# EAGLE design LED_Transmitter_2023_01_22_A (EAGLE 9.6.1)
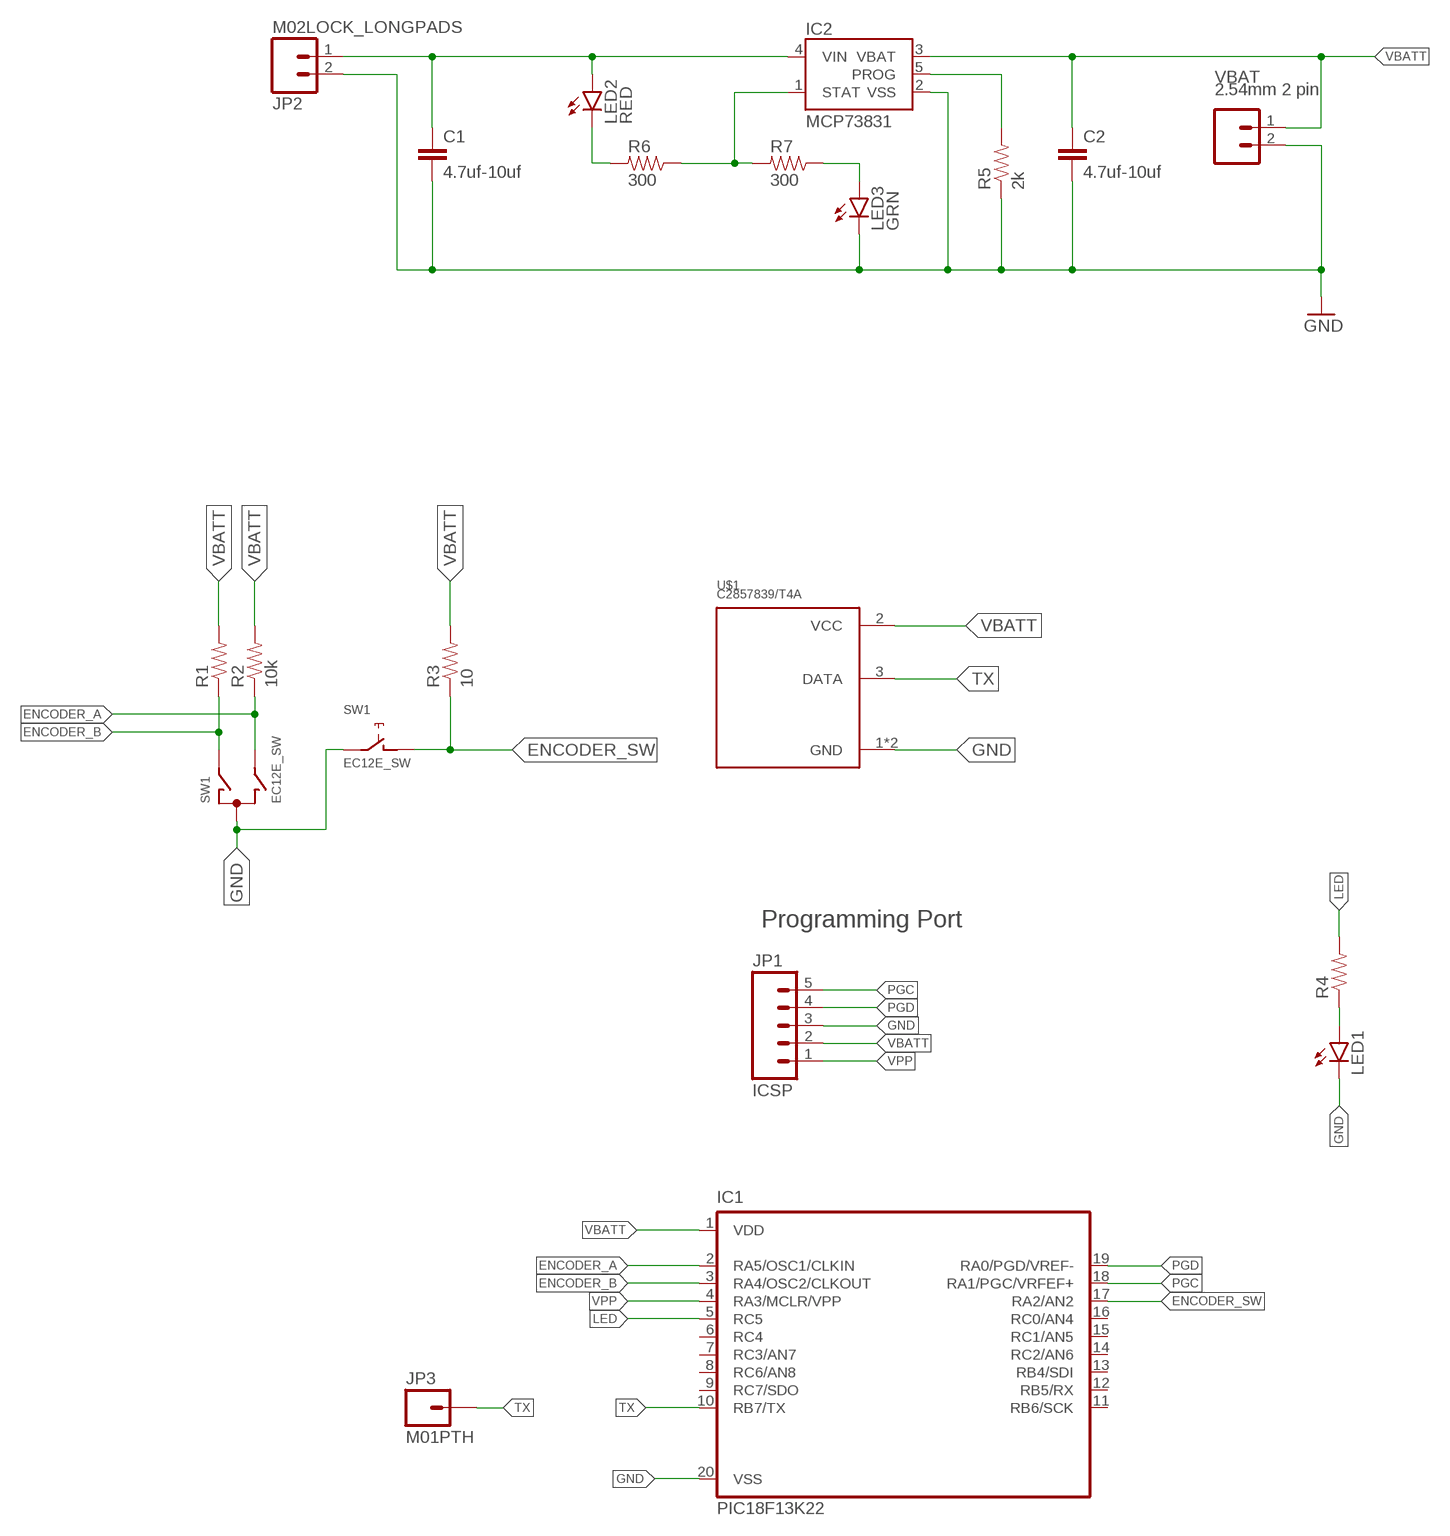
[diagram p0: schematic, sheet 1]

## Parts
C1  4.7uf-10uf  CAP1206  [1206]
C2  4.7uf-10uf  CAP1206  [1206]
IC1  PIC18F13K22  [DIL20]
IC2  MCP73831  [SOT23-5]
JP1  ICSP  M05PTH  [1X05]
JP2  M02LOCK_LONGPADS  [1X02_LOCK_LONGPADS]
JP3  M01PTH  [1X01]
LED1  LED1206  [LED-1206]
LED2  RED  LED1206  [LED-1206]
LED3  GRN  LED1206  [LED-1206]
R1  RESISTOR1206  [1206]
R2  10k  RESISTOR1206  [1206]
R3  10  RESISTOR1206  [1206]
R4  RESISTOR1206  [1206]
R5  2k  RESISTOR1206  [1206]
R6  300  RESISTOR1206  [1206]
R7  300  RESISTOR1206  [1206]
SW1  EC12E_SW  [ALPS_EC12E_SW]
U$1  C2857839/T4A  [1X04_LOCK_LONGPADS]
VBAT  2.54mm 2 pin  M02JST-PTH-VERT  [JST-2-PTH-VERT]

## Nets
ENCODER_A: IC1.2(RA5/OSC1/CLKIN) R2.1 SW1.B
ENCODER_B: IC1.3(RA4/OSC2/CLKOUT) R1.1 SW1.A
ENCODER_SW: IC1.17(RA2/AN2) R3.1 SW1.D
GND: C1.2 C2.2 IC1.20(VSS) IC2.2(VSS) JP1.3 JP2.2 LED1.C LED3.C R5.1 SW1.C SW1.E U$1.1(GND) U$1.4(GND) VBAT.2
LED: IC1.5(RC5) R4.2
N$1: LED1.A R4.1
N$3: LED2.C R6.2
N$6: IC2.1(STAT) R6.1 R7.2
N$7: IC2.5(PROG) R5.2
N$9: LED3.A R7.1
PGC: IC1.18(RA1/PGC/VRFEF+) JP1.5
PGD: IC1.19(RA0/PGD/VREF-) JP1.4
TX: IC1.10(RB7/TX) JP3.1 U$1.3(DATA)
VBATT: C2.1 IC1.1(VDD) IC2.3(VBAT) JP1.2 R1.2 R2.2 R3.2 U$1.2(VCC) VBAT.1
VBUS: C1.1 IC2.4(VIN) JP2.1 LED2.A
VPP: IC1.4(RA3/MCLR/VPP) JP1.1
Unconnected: IC1.6(RC4) IC1.7(RC3/AN7) IC1.8(RC6/AN8) IC1.9(RC7/SDO) IC1.11(RB6/SCK) IC1.12(RB5/RX) IC1.13(RB4/SDI) IC1.14(RC2/AN6) IC1.15(RC1/AN5) IC1.16(RC0/AN4) SW1.GND1(G) SW1.GND2(G)

## Notes on the sheet
- Programming Port

## Library data of the parts
C1 C2 = SparkFun-Capacitors:CAP: Capacitor Standard 0603 ceramic capacitor, and 0.1" leaded capacitor.
IC1 = PIC18F13k22:PIC18F13K22?: 18/20/28-Pin High-Performance, Enhanced Flash Microcontrollers with 10-bit A/D and nanoWatt Technology Source: ww1.microchip.com/downloads/en/DeviceDoc/39605c.pdf
IC2 = SparkFun-PowerIC:MCP73831: Miniature single cell, fully integrated Li-Ion, Li-polymer charge management controller http://ww1.microchip.com/downloads/en/DeviceDoc/21984a.pdf IC-09995; PROD_ID: IC-09995
JP1 = SparkFun-Connectors:M05: Header 5 Standard 5-pin 0.1" header. Use with straight break away headers (SKU : PRT-00116), right angle break away headers (PRT-00553), swiss pins (PRT-00743), machine pins (PRT-00117), and female headers (PRT-00115). Molex polarized connector foot print use with SKU : PRT-08230 with associated crimp pins and housings.
JP2 VBAT = SparkFun-Connectors:M02: Standard 2-pin 0.1" header. Use with - straight break away headers ( PRT-00116) - right angle break away headers (PRT-00553) - swiss pins (PRT-00743) - machine pins (PRT-00117) - female headers (PRT-00115) Molex polarized connector foot print use with: PRT-08233 with associated crimp pins and housings. 2.54_SCREWTERM for use with PRT-10571. 3.5mm Screw Terminal footprints for PRT-08084 5mm Screw Terminal footprints for use with PRT-08432
JP3 = SparkFun-Connectors:M01: Header 1 Standard 1-pin 0.1" header. Use with straight break away headers (SKU : PRT-00116), right angle break away headers (PRT-00553), swiss pins (PRT-00743), machine pins (PRT-00117), and female headers (PRT-00115).
LED1-LED3 = SparkFun-LED:LED: LEDs Standard schematic elements and footprints for 5mm, 3mm, 1206, and 0603 sized LEDs. 5mm - Spark Fun Electronics SKU : COM-00529 (and others)
R1-R7 = SparkFun-Resistors:RESISTOR: Resistor Basic schematic elements and footprints for 0603, 1206, and PTH resistors.
SW1 = switch-alps:EC12E_SW: ALPS rotary Encoder EC12E series with switch; MPN: EC12E2424407; OC_FARNELL: 1520813; OC_NEWARK: 74M1068
U$1 = Feng Niao RF Library:C2857839/T4A: C2857839//Yuan T4A Transmitter

## Board
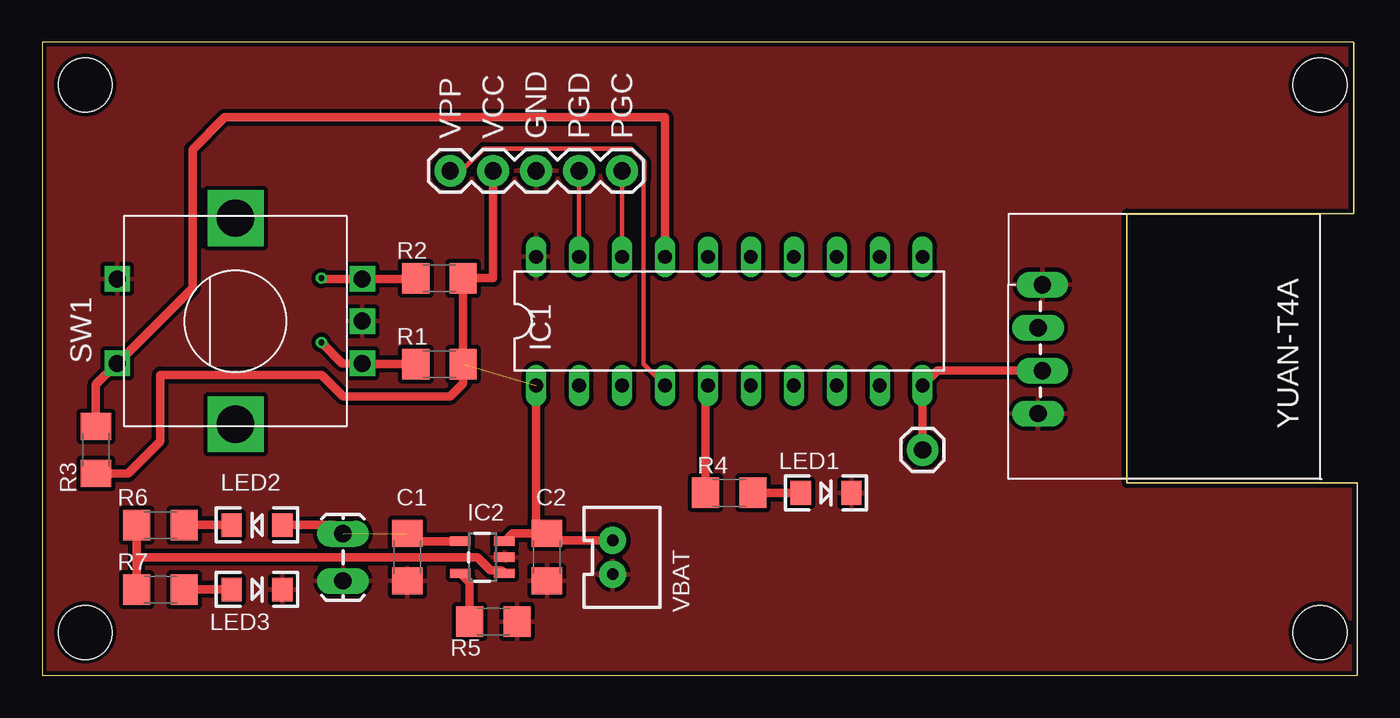
[diagram p1: board, top side]
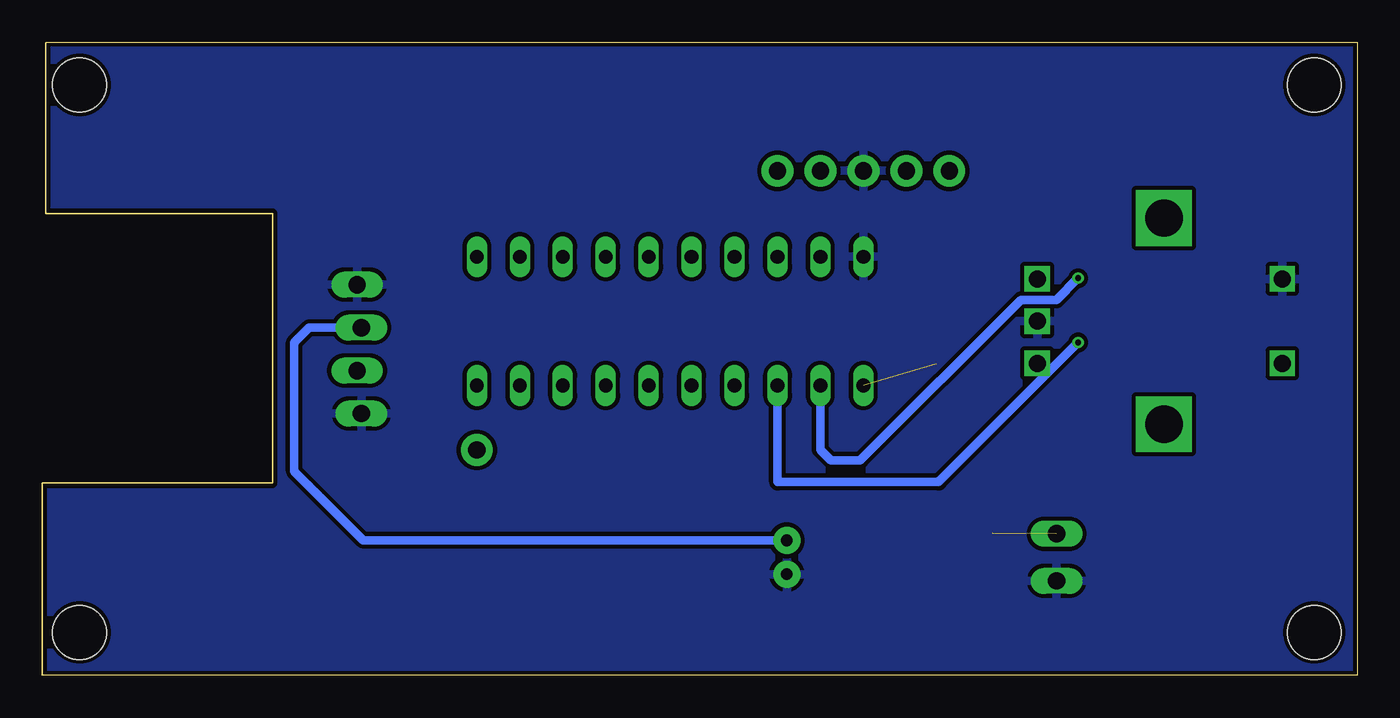
[diagram p2: board, bottom side, seen from below]

Size 77.78 x 37.45 mm. Coordinates in mm from the lower left corner, seen from the top.
Outline: 77.78,0 0,0 0,37.45 77.57,37.45
Outline: 77.78,0 77.78,0
Outline: 77.78,0 77.78,11.38 64.16,11.38 64.16,27.33 77.57,27.33 77.57,37.44
Copper layers (1*16): Top 0.035mm / dielectric 1.5mm / Bottom 0.035mm
Design rules "default": minimum track width 5mil, minimum drill 5mil, track to track 10mil, track to pad 10mil, pad to pad 10mil, via to via 10mil, smd to smd 6mil, copper to edge 10mil, drill to drill 6mil, minimum pad ring 6mil, minimum via ring 6mil, stop-mask expansion 4mil, vias tented up to drill 0mil, thermal gap 10mil
Holes 3.17 mm at 2.54,34.93 75.56,34.93 75.56,2.54 2.54,2.54

### Footprints (pad centres in the part's own frame; a part is rotated, then mirrored left to right if it is on the bottom)
1206 = smd 1.6 x 1.8: 1 -1.4,0; 2 1.4,0
DIL20 = drill 0.813 long: 1 -11.43,-3.81; 2 -8.89,-3.81; 3 -6.35,-3.81; 4 -3.81,-3.81; 5 -1.27,-3.81; 6 1.27,-3.81; 7 3.81,-3.81; 8 6.35,-3.81; 9 8.89,-3.81; 10 11.43,-3.81; 11 11.43,3.81; 12 8.89,3.81; 13 6.35,3.81; 14 3.81,3.81; 15 1.27,3.81; 16 -1.27,3.81; 17 -3.81,3.81; 18 -6.35,3.81; 19 -8.89,3.81; 20 -11.43,3.81
SOT23-5 = smd 0.55 x 1.2: 1 -0.95,-1.3; 2 0,-1.3; 3 0.95,-1.3; 4 0.95,1.3; 5 -0.95,1.3
1X05 = drill 1.016 pad 1.88: 1 0,0; 2 2.54,0; 3 5.08,0; 4 7.62,0; 5 10.16,0
1X02_LOCK_LONGPADS = drill 1.016 long: 1 -0.127,0; 2 2.667,0
1X01 = drill 1.016 pad 1.88: 1 0,0
LED-1206 = smd 1.2 x 1.4: A -1.5,0; C 1.5,0
ALPS_EC12E_SW = drill 1 square: A -2.5,-7.5; B 2.5,-7.5; C 0,-7.5; D -2.5,7; E 2.5,7 | drill 2.2 square: GND1 -6.1,0; GND2 6.1,0
1X04_LOCK_LONGPADS = drill 1.016 long: 1 4.2,2; 2 6.74,1.746; 3 9.28,2; 4 11.82,1.746
JST-2-PTH-VERT = drill 0.7 pad 1.6: 1 -1,-0.55; 2 1,-0.55

### Placement (x,y rotation side)
C1  21.59,6.99 270 top
C2  29.84,6.99 270 top
IC1  40.64,20.95 0 top
IC2  26.03,6.99 90 top
JP1  24.13,29.84 0 top
JP2  17.78,8.26 270 top
JP3  52.07,13.34 0 top
LED1  46.36,10.8 0 top
LED2  12.7,8.89 180 top
LED3  12.7,5.08 0 top
R1  23.49,18.41 0 top
R2  23.49,23.5 0 top
R3  3.18,13.34 270 top
R4  40.64,10.8 180 top
R5  26.67,3.18 180 top
R6  6.98,8.89 0 top
R7  6.98,5.08 180 top
SW1  11.43,20.95 90 top
U$1  57.15,27.3 270 top
VBAT  34.29,6.99 270 top

### Tracks (layer width: path | path; a pad name or v marks a point on that pad's centre or on a via)
ENCODER_A  (via drill 0.35)
  Top 0.508: R2.1 22.05,23.45 SW1.B 16.55,23.45 v16.51,23.5
  Bottom 0.508: v16.51,23.5 17.79,22.21 19.89,22.21 29.4,12.7 31.12,12.7 31.75,13.34 IC1.2
ENCODER_B  (via drill 0.35)
  Top 0.508: R1.1 18.97,18.41 SW1.A 17.74,18.45 v16.51,19.69
  Bottom 0.508: v16.51,19.69 24.77,11.43 34.29,11.43 IC1.3
ENCODER_SW
  Top 0.508: R3.1 3.18,17.2 SW1.D 8.89,22.91 8.89,31.12 10.79,33.02 36.83,33.02 IC1.17
GND
  pour Top: 0,42.55 79.38,42.55 80.01,41.91 81.28,40.64 81.28,-1.27 -0.63,-1.27 -1.27,-0.63 -1.27,41.27
  pour Bottom: -1.27,41.91 81.92,41.91 82.55,41.27 82.55,-3.81 -2.54,-3.81 -3.81,-2.54 -3.81,39.37
LED
  Top 0.508: R4.2 39.24,17.02 IC1.5
N$1
  Top 0.508: R4.1 LED1.A
N$3
  Top 0.508: LED2.C R6.2
N$6
  Top 0.508: R7.2 5.58,6.99 | 5.58,6.99 R6.1 | IC2.1 27.17,6.2 26.52,6.2 25.74,6.99 5.58,6.99
N$7
  Top 0.508: R5.2 25.27,5.5 IC2.5
N$9
  Top 0.508: LED3.A R7.1
PGC
  Top 0.254: JP1.5 IC1.18
PGD
  Top 0.254: IC1.19 JP1.4
TX
  Top 0.508: U$1.3 52.95,18.02 52.39,17.46 IC1.10 JP3.1
VBATT  (1 unrouted)
  Top 0.508: JP1.2 26.67,23.5 R2.2 R1.2 24.9,17.27 24.13,16.51 17.78,16.51 16.51,17.78 6.98,17.78 6.98,13.84 5.08,11.94 R3.2 | IC2.3 27.79,8.39 C2.1 | VBAT.1 30.25,7.99 C2.1 | IC1.1 29.21,9.02 C2.1
  Bottom 0.508: VBAT.1 58.79,7.99 62.86,12.07 62.86,19.69 61.98,20.57 U$1.2
VBUS  (1 unrouted)
  Top 0.508: IC2.4 22.04,7.94 C1.1 | LED2.A 17.27,8.89 JP2.1
VPP
  Top 0.254: JP1.1 24.8,29.84 26.12,31.17 34.84,31.17 35.61,30.39 35.61,29.3 35.56,29.25 35.56,18.41 IC1.4

### Text on the board
tPlace: VPP | VCC | GND | PGD | PGC